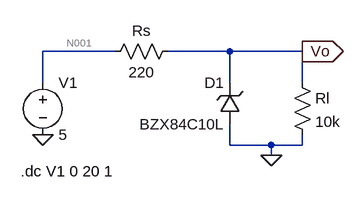
[diagram p0: schematic Shunt_Regulator.asc]
Shunt_Regulator.asc, the LTspice schematic file:
Version 4
SHEET 1 880 680
WIRE 192 96 80 96
WIRE 368 96 272 96
WIRE 480 96 368 96
WIRE 80 144 80 96
WIRE 368 144 368 96
WIRE 480 144 480 96
WIRE 368 240 368 208
WIRE 432 240 368 240
WIRE 480 240 480 224
WIRE 480 240 432 240
WIRE 432 256 432 240
FLAG 80 224 0
FLAG 432 256 0
FLAG 480 96 Vo
IOPIN 480 96 Out
SYMBOL voltage 80 128 R0
SYMATTR InstName V1
SYMATTR Value 5
SYMBOL res 288 80 R90
WINDOW 0 0 56 VBottom 2
WINDOW 3 32 56 VTop 2
SYMATTR InstName Rs
SYMATTR Value 220
SYMBOL res 464 128 R0
SYMATTR InstName Rl
SYMATTR Value 10k
SYMBOL zener 384 208 R180
WINDOW 0 24 64 Left 2
WINDOW 3 24 0 Left 2
SYMATTR InstName D1
SYMATTR Value BZX84C10L
TEXT 46 280 Left 2 !.dc V1 0 20 1

The netlist it stands for:
* Shunt_Regulator.asc
V1 N001 0 5
Rs Vo N001 220
Rl Vo 0 10k
D1 0 Vo BZX84C10L
.model D D
.lib standard.dio
.dc V1 0 20 1
.backanno
.end

* Results of the author's LTspice run, read from the files saved beside the schematic
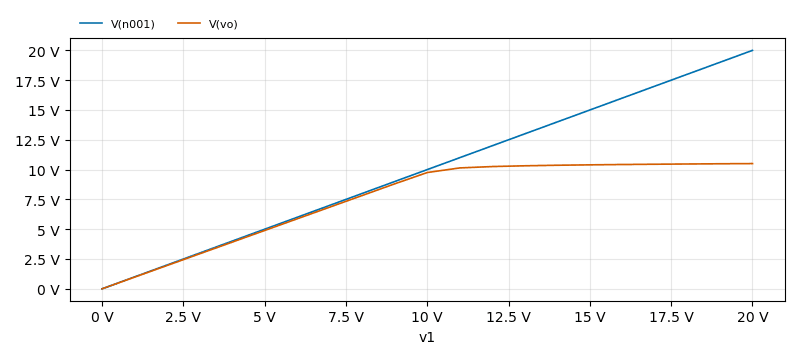
[diagram p1: DC transfer characteristic of Shunt_Regulator.asc, plotted from the saved traces]
* DC transfer characteristic, 1 run:
*   V(n001): 0 V at v1=0 V, 20 V at v1=20 V, min 0 V, max 20 V
*   V(vo): 0 V at v1=0 V, 10.5 V at v1=20 V, min 0 V, max 10.5 V